# Altium schematic sheet 2002_Pile-Accu.SchDoc
size A3; Author: Joao Marques Chaves; Organization: ETML-ES; Address1: Avenue Recordon 1; Address2: 1004 Lausanne; Address3: Switzerland; SheetNumber: 7; SheetTotal: 7; Version: C
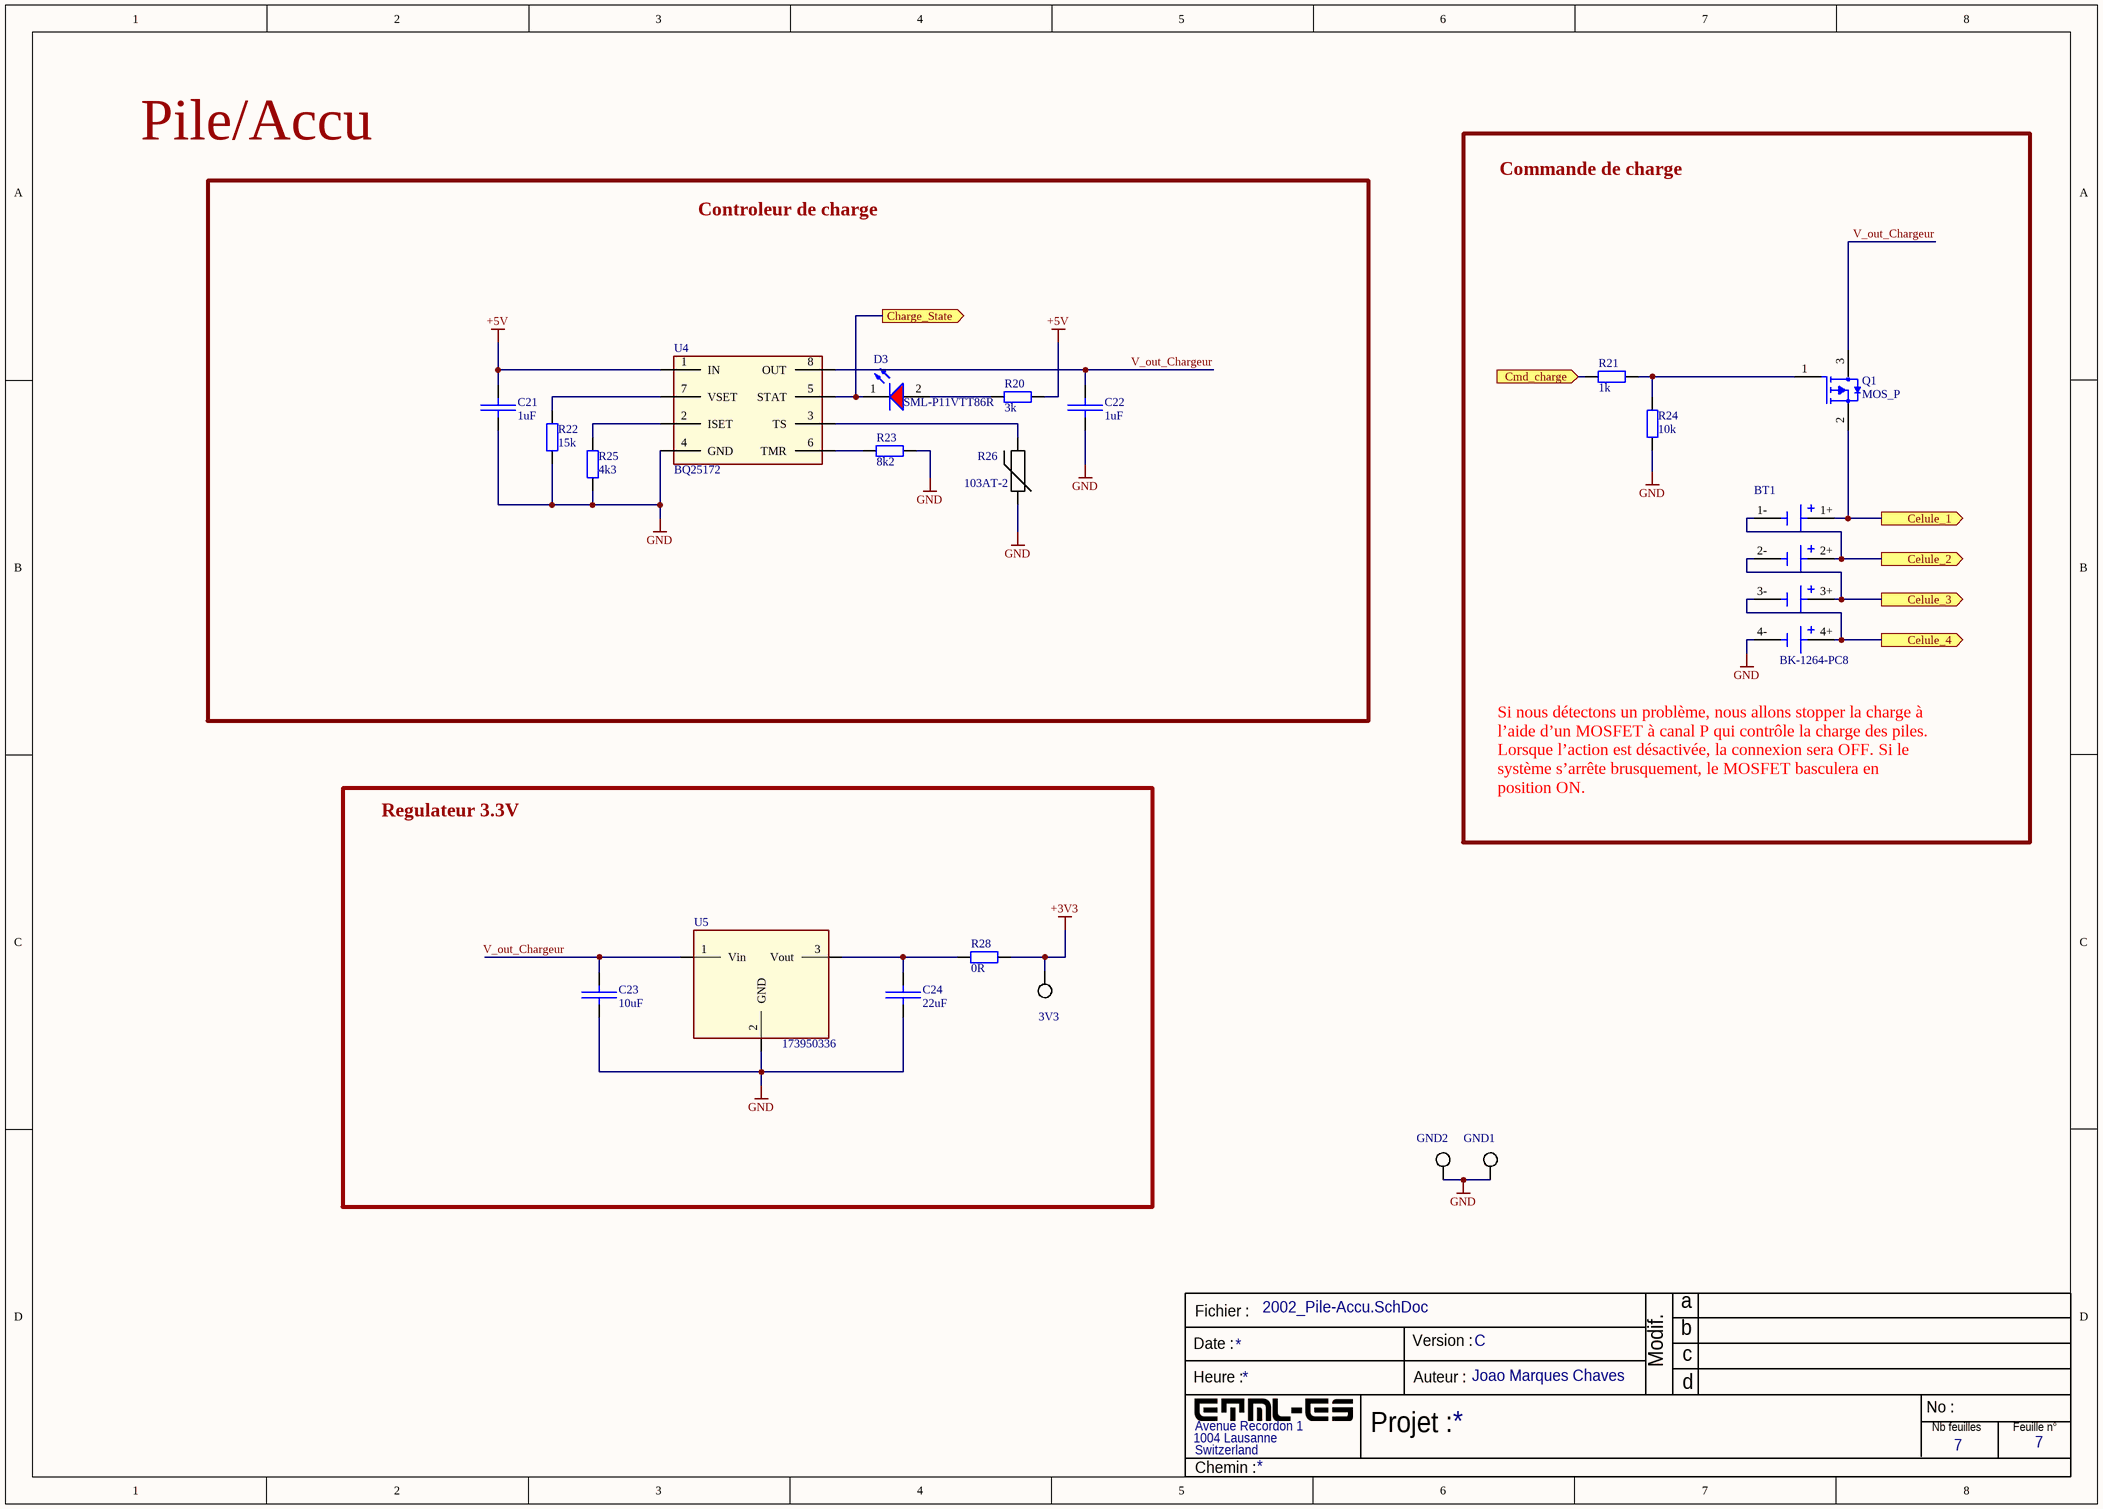
[diagram p0: 2002_Pile-Accu.SchDoc]

## Parts
3V3  5019  [TESTPOINT_SMD]  (value not drawn)
BT1  BK-1264-PC8  [BAT_BK-1264-PC8]
C21  1uF  [0805]
C22  1uF  [0805]
C23  10uF  [0805]
C24  22uF  [0805]
D3  SML-P11VTT86R  [LED_SML-P11VTT86R]
GND1  5019  [TESTPOINT_SMD]  (value not drawn)
GND2  5019  [TESTPOINT_SMD]  (value not drawn)
Q1  MOS_P  [SI5618-TP]
R20  value 3k  [0805]  (hidden comment: 3k2)
R21  1k  [0805]
R22  15k  [0805]
R23  8k2  [0805]
R24  10k  [0805]
R25  4k3  [0805]
R26  103AT-2  [103AT51PFT]
R28  0R  [0805]
U4  BQ25172  [BQ25172DSGR]
U5  173950336  [173950336]

## Blocks framed on the sheet
Commande de charge: BT1 Q1 R21 R24
Controleur de charge: C21 C22 D3 R20 R22 R23 R25 R26 U4
Regulateur 3.3V: 3V3 C23 C24 R28 U5

## Ports
Celule_1 (out), Celule_2 (out), Celule_3 (out), Celule_4 (out), Charge_State (out), Cmd_charge (in)

## Nets
+3V3: 3V3.1 R28.1
+5V: C21.1 R20.1 U4.1(IN)
GND: BT1.4- C21.2 C22.2 C23.2 C24.2 GND1.1 GND2.1 R22.1 R23.1 R24.1 R25.1 R26.2 U4.4(GND) U5.2(GND)
Celule_1: BT1.1+ Q1.2(S) ; port Celule_1
Celule_2: BT1.1- BT1.2+ ; port Celule_2
Celule_3: BT1.2- BT1.3+ ; port Celule_3
Celule_4: BT1.3- BT1.4+ ; port Celule_4
Charge_State: D3.1(K) U4.5(STAT) ; port Charge_State
Cmd_charge: R21.2 ; port Cmd_charge
V_out_Chargeur: C22.1 C23.1 Q1.3(D) U4.8(OUT) U5.1(Vin)
NetC24_1: C24.1 R28.2 U5.3(Vout)
NetD3_2: D3.2(A) R20.2
NetQ1_1: Q1.1(G) R21.1 R24.2
NetR22_2: R22.2 U4.7(VSET)
NetR23_2: R23.2 U4.6(TMR)
NetR25_2: R25.2 U4.2(ISET)
NetR26_1: R26.1 U4.3(TS)

## Notes on the sheet
- Pile/Accu
- Si nous détectons un problème, nous allons stopper la charge à l’aide d’un MOSFET à canal P qui contrôle la charge des piles. Lorsque l’action est désactivée, la connexion sera OFF. Si le système s’arrête brusquement, le MOSFET basculera en position ON.
- Fichier :
- a
- Date :
- Heure :
- Version :
- Auteur :
- Modif.
- b
- c
- d
- Projet :
- No :
- Nb feuilles
- Feuille n°
- Chemin :

## Library data of the parts
3V3 GND1 GND2 = TESTPOINT: Test point smd
BT1 = BK-1264-PC8: Battery Holder (Open) AAA 4 Cell PC Pin; Package: None; Price: None; Value: *; MP: BK-1264-PC8; Availability: Unavailable
C21-C24 = Condensator: Capacitor smd
  C21 C22: Value: 1uF
  C23: Value: 10uF
  C24: Value: 22uF
D3 = 150080SS75000: WL-SMCW Mono-color Chip LED Waterclear, size 0805, Super Red, 1.9V, 140°; Manufacturer: Wurth Elektronik; Case/Size Code: 0805; Chip Technology: AlInGaP; Dominant Wavelength: 630nm; Luminous Intensity: 60mcd; Peak Wavelength: 645nm; Manufacturer Part Number: 150080SS75000; Category: Signal LEDs; Match Code: WL-SMCW; ComponentLink1Description: Website Link; ComponentLink1URL: https://www.we-online.com/redexpert/article/150080SS75000?ad; ComponentLink2Description: Datasheet Link; ComponentLink2URL: https://www.we-online.com/redexpert/spec/150080SS75000?ad; Mount: Surface Mount; Operating Temperature Max: 85°C; Operating Temperature Min: -40°C; Packaging: Tape and Reel; Length: 2mm; Width: 1.25mm; Height: 0.7mm; Emitting Color: Super Red; Forward Voltage: 1.9V; Viewing Angle: 140°
R20 R22-R25 R28 = Res2_1: Resistor smd; Published: 8-Jun-2000; LatestRevisionDate: 17-Jul-2002; LatestRevisionNote: Re-released for DXP Platform.; PackageReference: AXIAL-0.4; Publisher: Altium Limited; PackageDescription: Axial Device, Thru-Hole; 2 Leads; 0.4 in Pin Spacing
  R22: Value: 15k
  R23: Value: 8k2
  R24: Value: 10k
  R25: Value: 4k3
  R28: Value: 0R
R21 = Res2: Resistor smd; Published: 8-Jun-2000; LatestRevisionDate: 17-Jul-2002; LatestRevisionNote: Re-released for DXP Platform.; PackageReference: AXIAL-0.4; Publisher: Altium Limited; PackageDescription: Axial Device, Thru-Hole; 2 Leads; 0.4 in Pin Spacing; Value: 1k
R26 = 103AT-2: thermistor; ComponentLink1Description: distributeur; ComponentLink1URL: https://www.mouser.ch/ProductDetail/Semitec/103AT-2?qs=wgO0AD0o1vvcDzsKguD%252Bew%3D%3D; ComponentLink2Description: Datasheet; ComponentLink2URL: https://www.mouser.ch/datasheet/2/362/semitec_atthermistor-1202913.pdf
U4 = BQ25172: Linear Battery Charger for 1- to 6-Cell NiMH Batteries; ComponentLink1Description: Datasheet; ComponentLink1URL: https://www.ti.com/lit/ds/symlink/bq25172.pdf?ts=1723181325396&ref_url=https%253A%252F%252Fwww.ti.com%252Fproduct%252FBQ25172%253Fbm-verify%253DAAQAAAAJ_____wF_Ss5Mx06KPY5wuR_GF74KlZYjgF463_PIRlVM87DaDimX8hD-z5276A7B4TIBZX0NkuoKNaHBi_BIZQjDV1LkEa4XRsG8u1VR9BofVYTDsa9KgQteCP0sYfXOG9XXdaIOCU4KV78p5I1mhsmEOew16_50esNWIwSvDA3hHiIVf5i8-2P7KThDd6J7Jl4hgoO4l1TC-NrfqnpFAYdm-pJ9AU9Ln766c7PomkWTcyYO1H9qEKlA_yTBE6jjSW5w3O45YuJnRCFg0pGldNq3fYTHPtlSH1bEqJ5IycH_AYGXDBQnkfkbRS1wfv-ZE-mPqIHZclsKyH4WNfY1MM8vqArrSoJICNJdn9XZRI90A8FZbu-ed-N5SM80SaNCRuUgfrfBEdcsRTe5V1SxlZb-1CspPmd3; ComponentLink2Description: distributeur; ComponentLink2URL: https://www.mouser.ch/ProductDetail/Texas-Instruments/BQ25172DSGR?qs=tlsG%2FOw5FFgckLJXIVn4PA%3D%3D
U5 = 173950336: DC DC CONVERTER 3.3V; ComponentLink1Description: distributeur; ComponentLink1URL: https://www.mouser.ch/ProductDetail/Wurth-Elektronik/173950336?qs=d0WKAl%252BL4KZw6hIvUkPbpg%3D%3D; N° de fab. :: 173950336; N° Mouser :: 710-173950336; ComponentLink2Description: Datasheet; ComponentLink2URL: https://www.we-online.com/components/products/datasheet/173950336.pdf
Q1 = MOS_P: ComponentLink1Description: New link; ComponentLink1URL: https://www.mouser.ch/ProductDetail/Micro-Commercial-Components-MCC/SI5618-TP?qs=GedFDFLaBXHJp%2FsrOFCJpg%3D%3D